# EasyEDA schematic SCH_RDA5807FP便携式收音机-孤独摇滚_2024-04-29.json
TITLE: Sheet_1; REV: 1.0; Date: 2022-12-13; Sheet: 1/1; Drawn By: jfythg; Company: Your Company
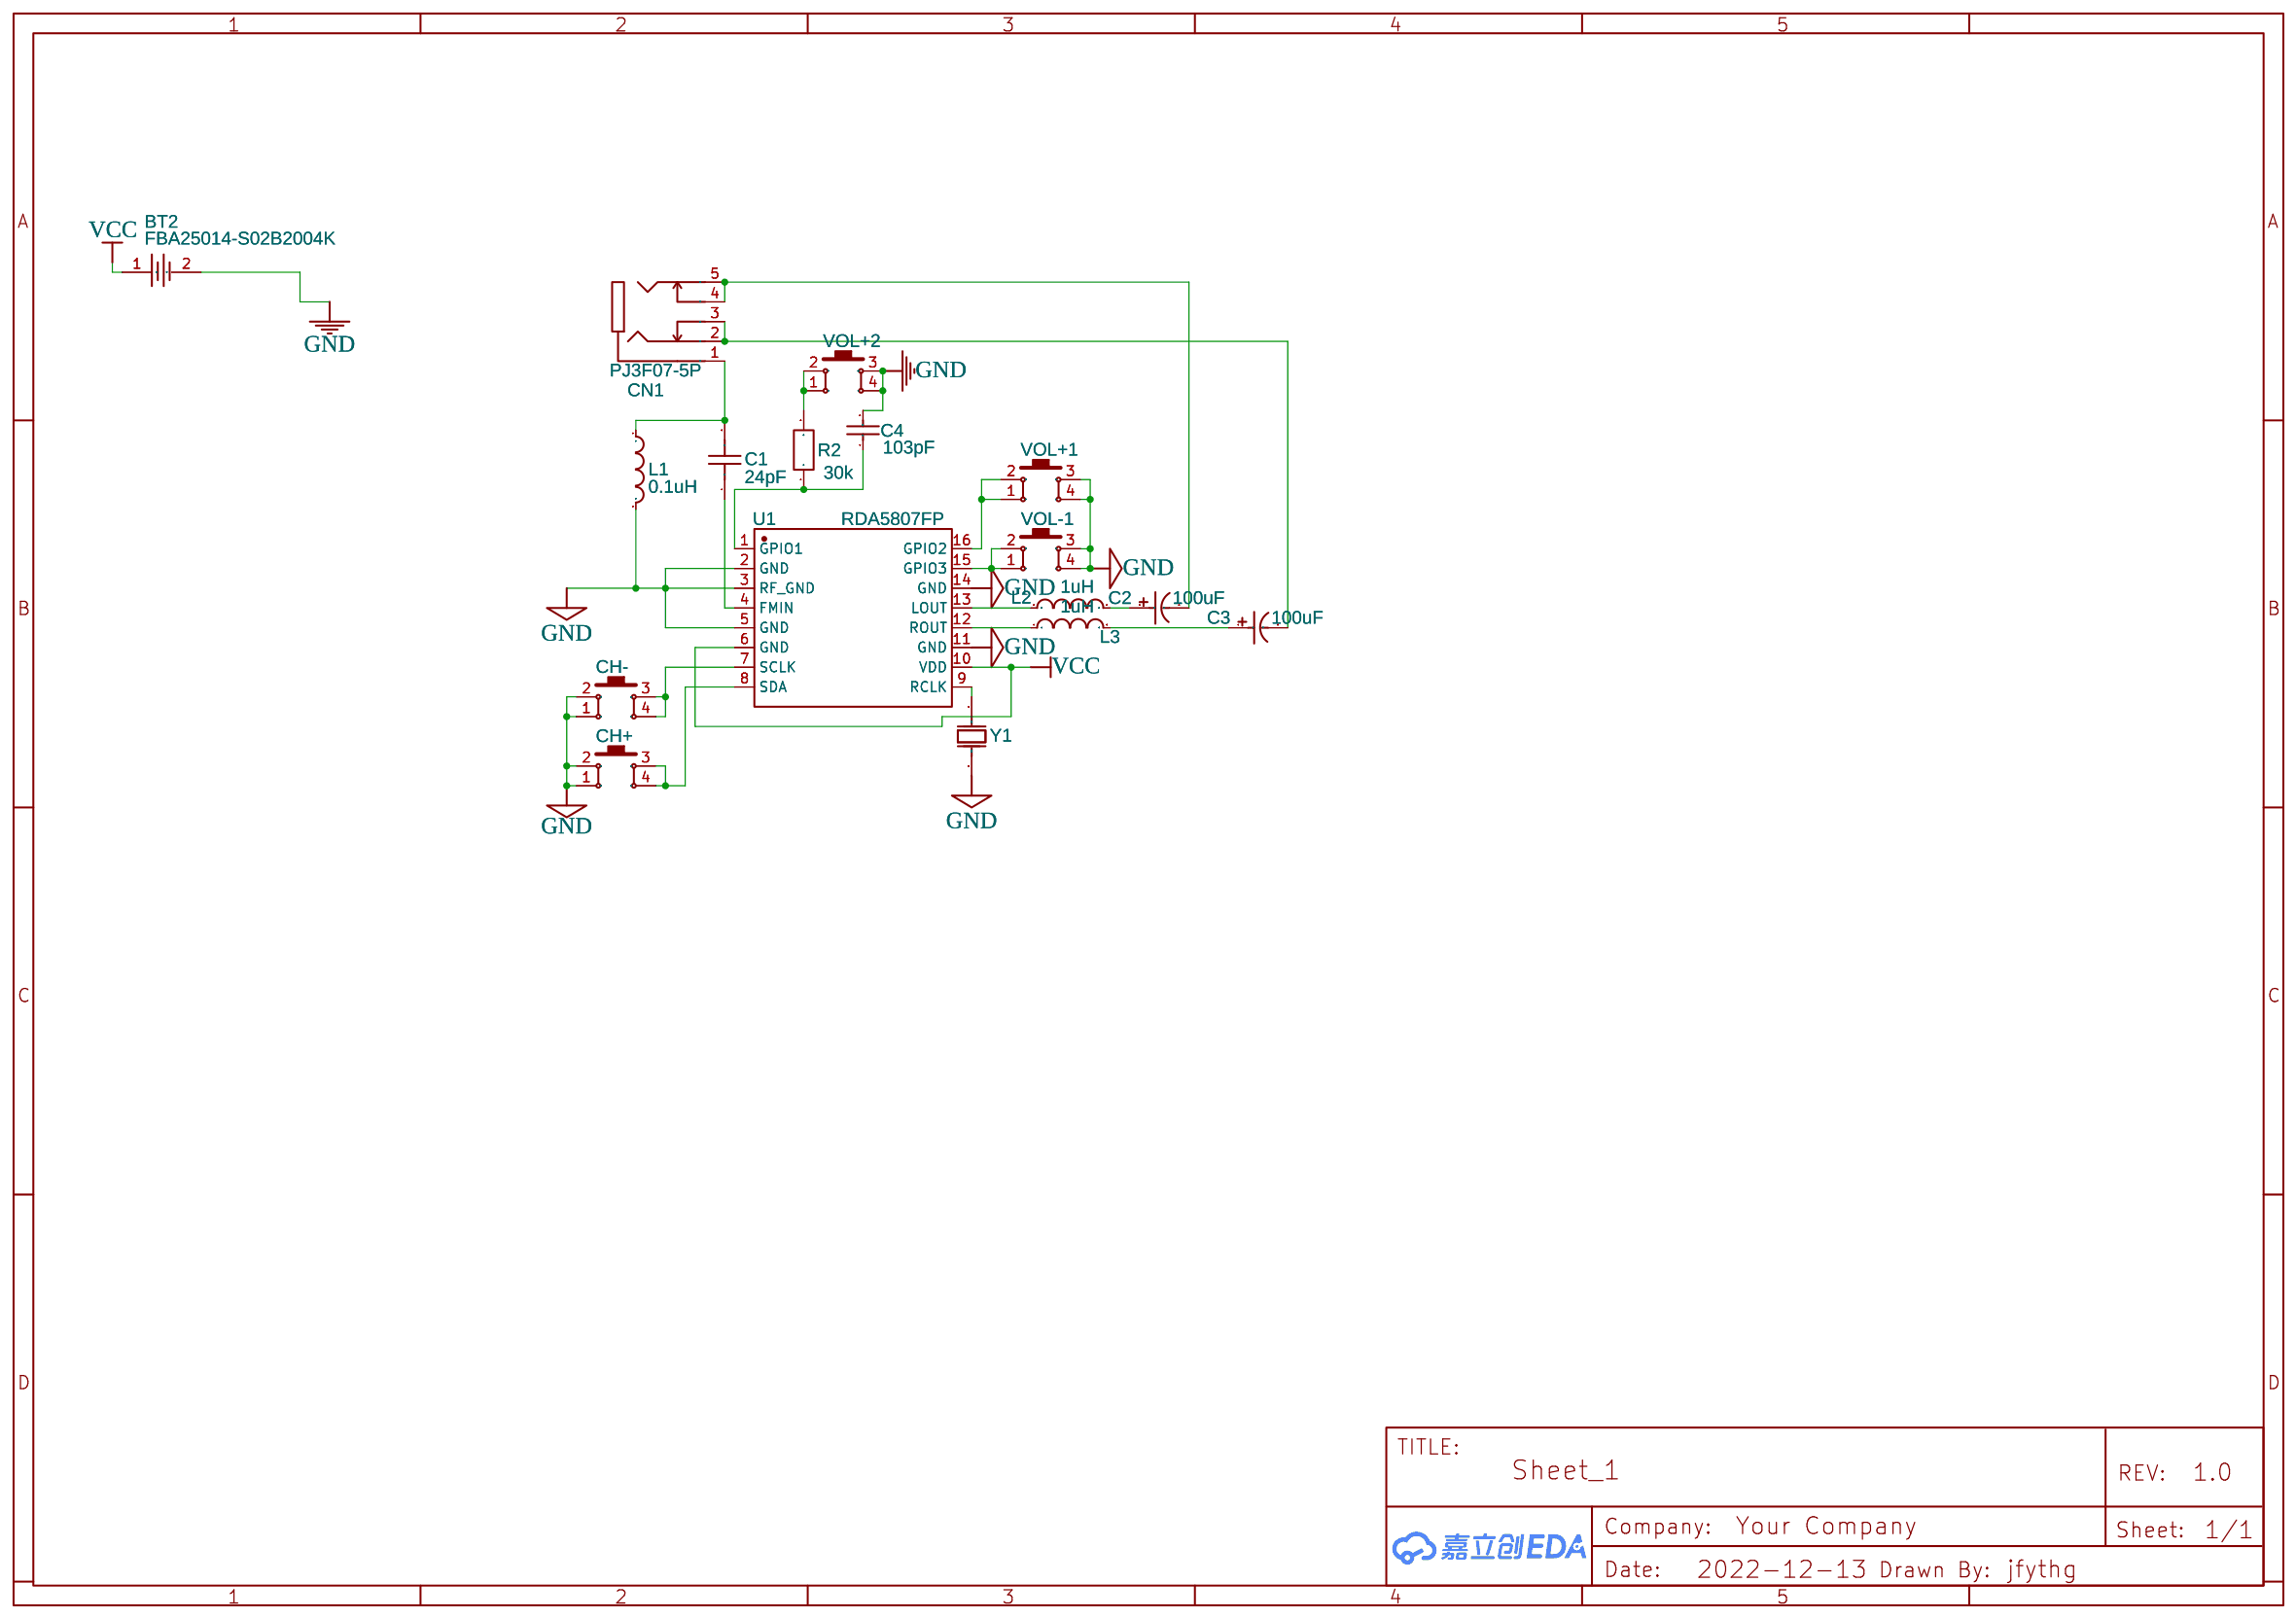
[diagram p0: schematic sheet]

## Parts
BT2  FBA25014-S02B2004K  [BAT-TH_FBA25014-S02B2004K]
C1  24pF  [C0603]
C2  100uF  [CAP-TH_BD6.3-P2.50-D1.0-FD]
C3  100uF  [CAP-TH_BD6.3-P2.50-D1.0-FD]
C4  103pF  [瓷片电容]
CH+  按键开关  [KEY-SMD_4P-L6.1-W6.1-P4.50-LS9.0]
CH-  按键开关  [KEY-SMD_4P-L6.1-W6.1-P4.50-LS9.0]
CN1  PJ3F07-5P  [AUDIO-TH_PJ3F07-5P]
L1  0.1uH  [L0603]
L2  1uH  [L0603]
L3  1uH  [L0603]
R2  30k  [直插电阻]
U1  RDA5807FP  [SOP-16_L10.0-W3.9-P1.27-LS6.0-BL]
VOL+1  按键开关  [KEY-SMD_4P-L6.1-W6.1-P4.50-LS9.0]
VOL+2  按键开关  [KEY-SMD_4P-L6.1-W6.1-P4.50-LS9.0]
VOL-1  按键开关  [KEY-SMD_4P-L6.1-W6.1-P4.50-LS9.0]
Y1  32.768KHz  [OSC-TH_BD2.0-P0.70-D0.3]

## Library data of the parts
BT2 = FBA25014-S02B2004K: Supplier: LCSC; Supplier Part: C2833828; Manufacturer: TXGA(特思嘉); Contributor: LCSC; JLCPCB Part Class: Extended Part
C1 = C_0805_US: Contributor: LCEDA_Lib
C2 C3 = ERR1EM101E11OT: Supplier: LCSC; Manufacturer: CX(承兴); Manufacturer Part: KM107M050F12RR0VH2FP0; Supplier Part: C2749; JLCPCB Part Class: Extended Part
C4 = 无极性电容: Contributor: hhdsdy
CH+ CH- VOL+1 VOL+2 VOL-1 = 按键开关: Supplier: LCSC; Supplier Part: C2834903; Manufacturer: Yuandi(台湾元迪); Manufacturer Part: TS-1095PD-A9B3-D2; Contributor: LCEDA-02
CN1 = PJ3F07-5P: Supplier: LCSC; Supplier Part: C668604; Manufacturer: SHOU HAN; Contributor: LCSC; JLCPCB Part Class: Extended Part
L1-L3 = L0805_US: Contributor: LCEDA_Lib
R2 = 直插电阻: Supplier: 飞思腾; Manufacturer Part: CFR03SJ0511A20; Manufacturer: UniOhm; Supplier Part: C30051; Contributor: 屏蔽器团队
U1 = RDA5807FP: Supplier: LCSC; Supplier Part: C77689; Manufacturer: RDA Microelectronics; Contributor: LCSC; JLCPCB Part Class: Extended Part
Y1 = TDXLF-206 32.768KHZ 12.5PF 20PPM: Supplier: LCSC; Supplier Part: C145163; Manufacturer: Zhejiang Abel Elec; Manufacturer Part: TAXD32768K2BGDAZT2T; Contributor: LCSC; JLCPCB Part Class: Extended Part

## Nets
GND: BT2.2 C4.2 CH+.1 CH+.2 CH-.1 CH-.2 L1.2 U1.2(GND) U1.3(RF GND) U1.5(GND) U1.11(GND) U1.14(GND) VOL+1.3 VOL+1.4 VOL+2.3 VOL+2.4 VOL-1.3 VOL-1.4 Y1.2(OSC2)
VCC: BT2.1 U1.6(GND) U1.10(VDD)
Net-(C1-1): C1.1 U1.4(FMIN)
Net-(C1-2): C1.2 CN1.1(A) L1.1
Net-(C2-1): C2.1 L2.2
Net-(C2-2): C2.2 CN1.4(D) CN1.5(E)
Net-(C3-1): C3.1 L3.2
Net-(C3-2): C3.2 CN1.2(B) CN1.3(C)
Net-(C4-1): C4.1 R2.1 U1.1(GPIO1)
Net-(CH+-3): CH+.3 CH+.4 U1.8(SDA)
Net-(CH--3): CH-.3 CH-.4 U1.7(SCLK)
Net-(L2-1): L2.1 U1.13(LOUT)
Net-(L3-1): L3.1 U1.12(ROUT)
Net-(R2-2): R2.2 VOL+2.1 VOL+2.2
Net-(U1-9): U1.9(RCLK) Y1.1(OSC1)
Net-(U1-15): U1.15(GPIO3) VOL-1.1 VOL-1.2
Net-(U1-16): U1.16(GPIO2) VOL+1.1 VOL+1.2
